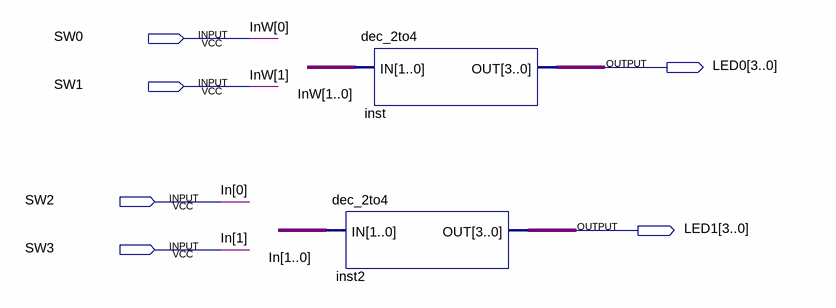
[diagram p0: schematic sheet]
// Quartus schematic start_2.bdf as structural Verilog: 2 symbols, 6 pins
module start_2 (
  input  SW0,
  input  SW1,
  input  SW2,
  input  SW3,
  output [3:0] LED0,
  output [3:0] LED1
);

  dec_2to4 inst2 (.IN({SW3, SW2}), .OUT(LED1));
  dec_2to4 inst (.IN({SW1, SW0}), .OUT(LED0));

  // Other names for the same wires on the sheet: In[1:0] = {SW3, SW2}; InW[1:0] = {SW1, SW0}
endmodule
